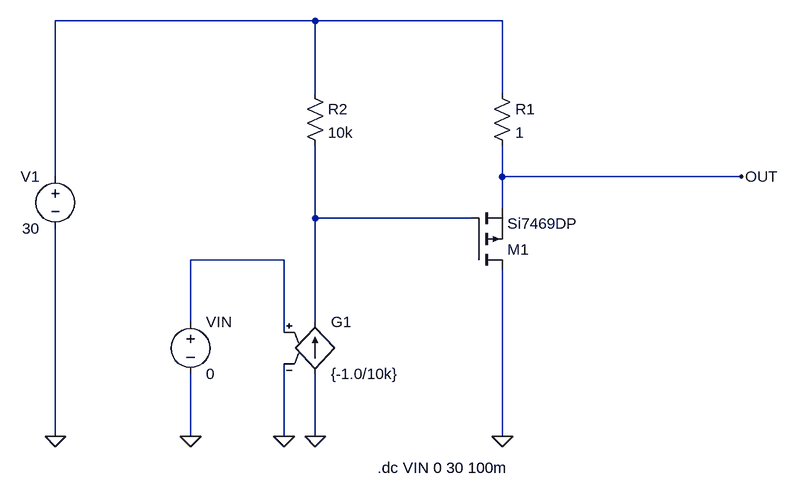
[diagram p0: schematic Current_Sinking_PMOS_Source_Follower.asc]
Current_Sinking_PMOS_Source_Follower.asc, the LTspice schematic file:
Version 4.1
SHEET 1 1028 680
WIRE 304 -368 -96 -368
WIRE 592 -368 304 -368
WIRE 304 -256 304 -368
WIRE 592 -256 592 -368
WIRE -96 -128 -96 -368
WIRE 592 -128 592 -176
WIRE 960 -128 592 -128
WIRE 592 -80 592 -128
WIRE 304 -64 304 -176
WIRE 544 -64 304 -64
WIRE 256 0 112 0
WIRE 112 96 112 0
WIRE 304 96 304 -64
WIRE 256 112 256 0
WIRE -96 272 -96 -48
WIRE 112 272 112 176
WIRE 256 272 256 160
WIRE 304 272 304 176
WIRE 592 272 592 16
FLAG -96 272 0
FLAG 592 272 0
FLAG 960 -128 OUT
FLAG 112 272 0
FLAG 256 272 0
FLAG 304 272 0
SYMBOL voltage -96 -144 M0
WINDOW 123 0 0 Left 0
WINDOW 39 0 0 Left 0
SYMATTR InstName V1
SYMATTR Value 30
SYMBOL voltage 112 80 R0
WINDOW 123 0 0 Left 0
WINDOW 39 0 0 Left 0
SYMATTR InstName VIN
SYMATTR Value 0
SYMBOL pmos 544 16 M180
SYMATTR InstName M1
SYMATTR Value Si7469DP
SYMBOL res 576 -272 R0
SYMATTR InstName R1
SYMATTR Value 1
SYMBOL g 304 80 R0
SYMATTR InstName G1
SYMATTR Value {-1.0/10k}
SYMBOL res 288 -272 R0
SYMATTR InstName R2
SYMATTR Value 10k
TEXT 400 320 Left 2 !.dc VIN 0 30 100m

The netlist it stands for:
* Current_Sinking_PMOS_Source_Follower.asc
V1 N001 0 30
VIN N003 0 0
M1 0 N002 OUT OUT Si7469DP
R1 N001 OUT 1
G1 0 N002 N003 0 {-1.0/10k}
R2 N001 N002 10k
.model NMOS NMOS
.model PMOS PMOS
.lib standard.mos
.dc VIN 0 30 100m
.backanno
.end